# EAGLE design XBP (EAGLE 7.2.0)
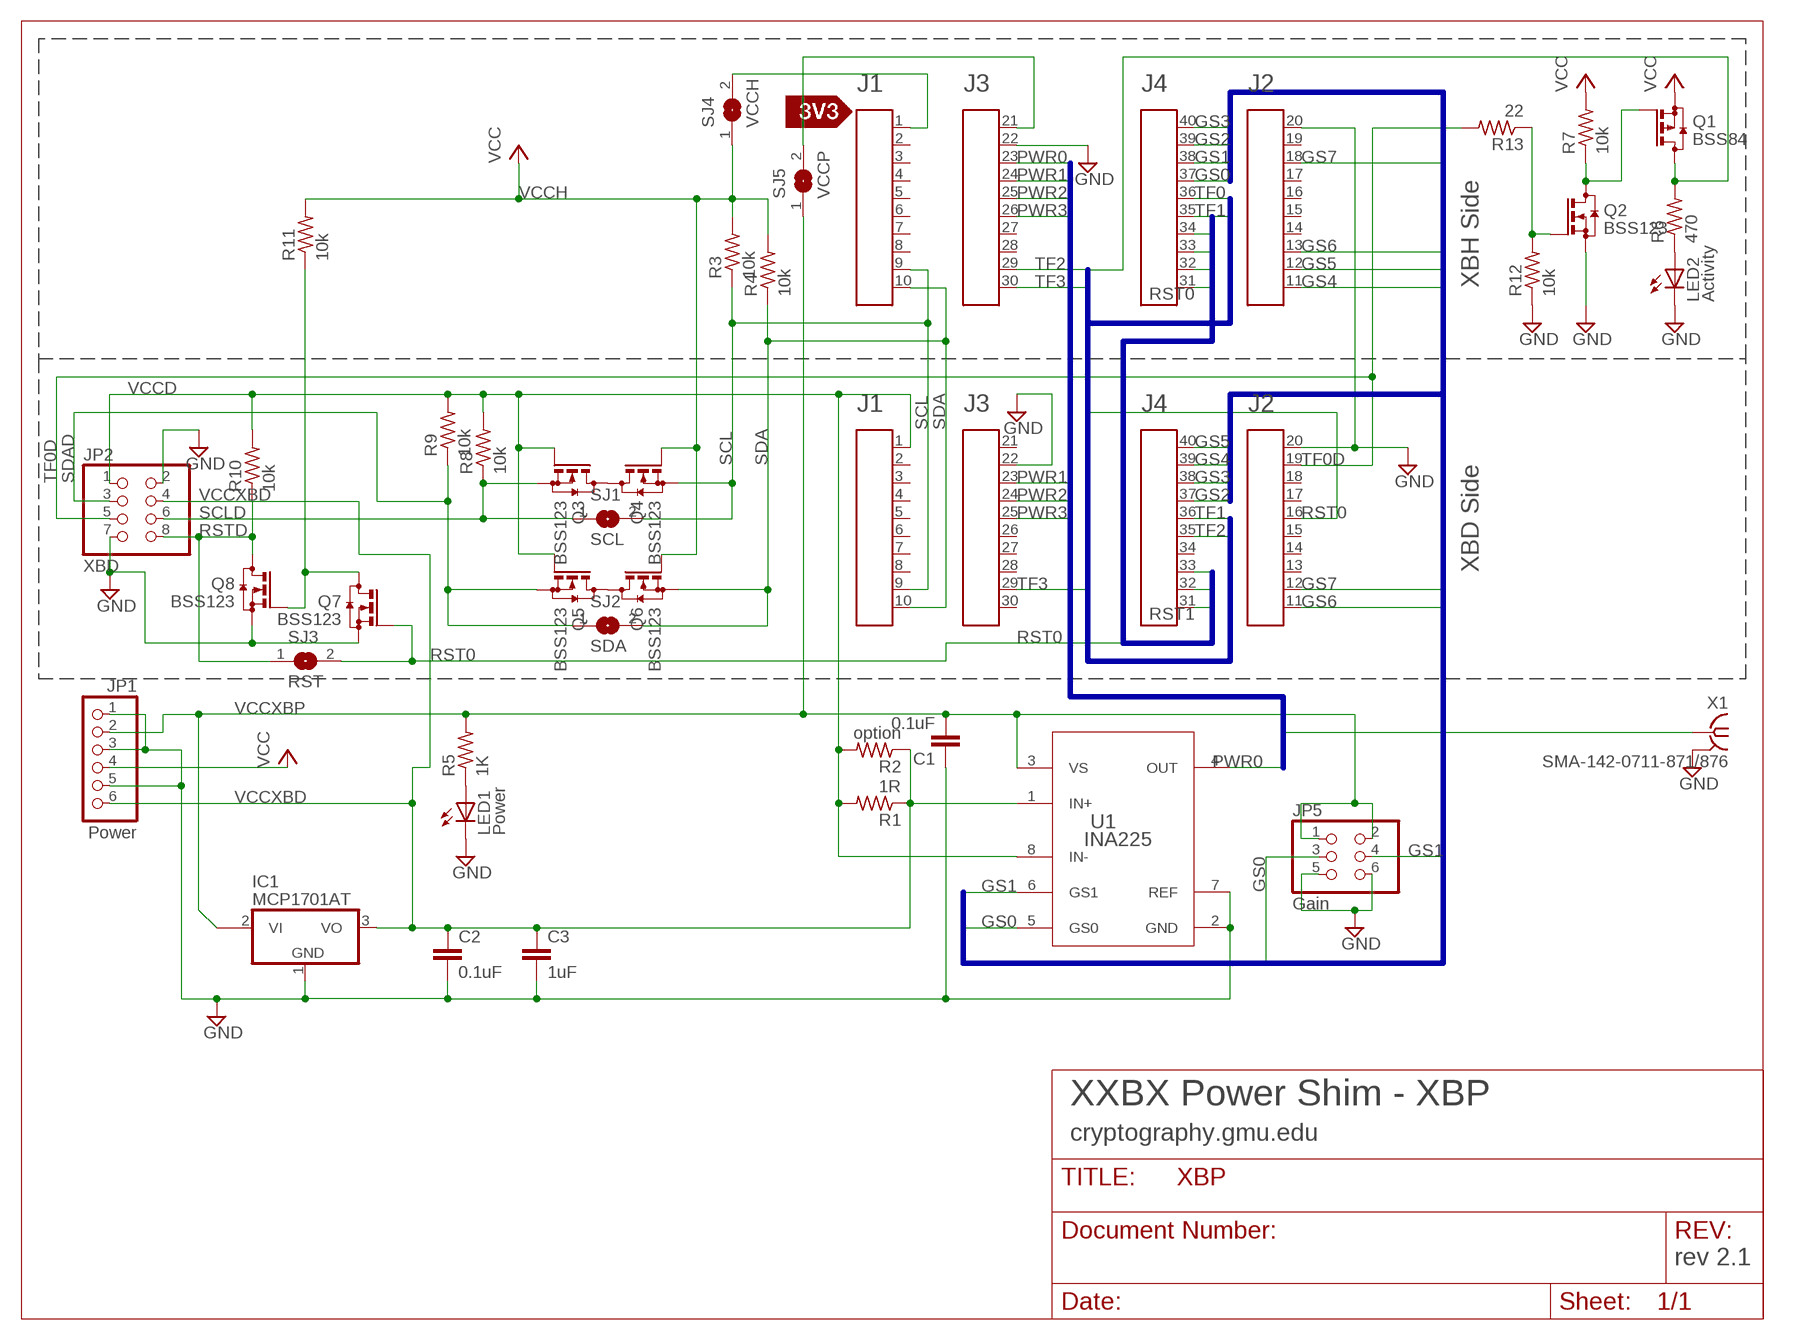
[diagram p0: schematic, sheet 1]

## Parts
A1  XBHCon  HEADER4X10-BOOSTERPACK  [4X10-BOOSTERPACK]
A2  XBDCon  HEADER4X10-BOOSTERPACK  [4X10-BOOSTERPACK]
C1  0.1uF  C-EUC0603  [C0603]
C2  0.1uF  C-EUC0603  [C0603]
C3  1uF  C-EUC0603  [C0603]
IC1  MCP1701AT  MCP170350MB  [SOT89]
JP1  Power  PINHD-1X6/90  [1X06/90]
JP2  XBD  PINHD-2X4/90  [2X04/90]
JP5  Gain  PINHD-2X3  [2X03]
LED1  Power  LEDCHIPLED_0603  [CHIPLED_0603]
LED2  Activity  LEDCHIPLED_0603  [CHIPLED_0603]
Q1  BSS84  [SOT23]
Q2  BSS123  [SOT23]
Q3  BSS123  [SOT23]
Q4  BSS123  [SOT23]
Q5  BSS123  [SOT23]
Q6  BSS123  [SOT23]
Q7  BSS123  [SOT23]
Q8  BSS123  [SOT23]
R1  1R  R-US_R1210  [R1210]
R2  option  R-US_R0805  [R0805]
R3  10k  R-US_R0603  [R0603]
R4  10k  R-US_R0603  [R0603]
R5  1K  R-US_R0603  [R0603]
R6  470  R-US_R0603  [R0603]
R7  10k  R-US_R0603  [R0603]
R8  10k  R-US_R0603  [R0603]
R9  10k  R-US_R0603  [R0603]
R10  10k  R-US_R0603  [R0603]
R11  10k  R-US_R0603  [R0603]
R12  10k  R-US_R0603  [R0603]
R13  22  R-US_R0603  [R0603]
SJ1  SCL  SJ  [SJ]
SJ2  SDA  SJ  [SJ]
SJ3  RST  SJ  [SJ]
SJ4  VCCH  SJ  [SJ]
SJ5  VCCP  SJ  [SJ]
U1  INA225  INA225AIDGKR  [DGK0008A_N]
U3  SILK_3V3_TAG  [SILK_3V3_TAG]
X1  SMA-142-0711-871/876  [J502-ND-142-0711-871/876]

## Nets
GND: A1.20 A1.22 A2.20 A2.22 C1.1 C2.2 C3.2 IC1.1(GND) JP1.1 JP1.3 JP1.5 JP2.2 JP2.7 JP5.5 JP5.6 LED1.C LED2.C Q2.2(S) Q7.2(S) Q8.2(S) R12.1 U1.2(GND) U1.7(REF) X1.G@1 X1.G@2 X1.G@3 X1.G@4
GS0: A1.37 JP5.3 U1.5(GS0)
GS1: A1.38 JP5.4 U1.6(GS1)
GS2: A1.39 A2.37
GS3: A1.40 A2.38
GS4: A1.11 A2.39
GS5: A1.12 A2.40
GS6: A1.13 A2.11
GS7: A1.18 A2.12
N$1: A1.1 SJ4.2
N$2: A1.21 SJ5.2
N$3: LED1.A R5.1
N$4: Q2.1(G) R12.2 R13.1
N$5: LED2.A R6.1
N$7: Q3.3(D) Q4.3(D)
N$9: Q5.3(D) Q6.3(D)
N$10: Q1.1(G) Q2.3(D) R7.1
N$12: Q7.3(D) Q8.1(G) R11.1
PWR0: A1.23 U1.4(OUT) X1.1
PWR1: A1.24 A2.23
PWR2: A1.25 A2.24
PWR3: A1.26 A2.25
RST0: A1.31 A2.16 Q7.1(G) SJ3.2
RST1: A1.32 A2.31
RST2: A1.33 A2.32
RST3: A1.34 A2.33
RSTD: JP2.8 Q8.3(D) R10.1 SJ3.1
SCL: A1.9 A2.9 Q4.2(S) R3.1 SJ1.2
SCLD: JP2.6 Q3.2(S) R8.1 SJ1.1
SDA: A1.10 A2.10 Q6.2(S) R4.1 SJ2.2
SDAD: JP2.3 Q5.2(S) R9.1 SJ2.1
TF0: A1.36 Q1.3(D) R6.2
TF0D: A2.19 JP2.5 R13.2
TF1: A1.35 A2.36
TF2: A1.29 A2.35
TF3: A1.30 A2.29
VCCD: A2.1 JP2.1 Q3.1(G) Q5.1(G) R1.2 R2.2 R8.2 R9.2 R10.2 U1.8(IN-)
VCCH: JP1.4 Q1.2(S) Q4.1(G) Q6.1(G) R3.2 R4.2 R7.2 R11.2 SJ4.1 ; supply symbol labelled VCC
VCCXBD: C2.1 C3.1 IC1.3(VO) JP1.6 JP2.4 R1.1 R2.1 U1.1(IN+)
VCCXBP: C1.2 IC1.2@1(VI1) JP1.2 JP5.1 JP5.2 R5.2 SJ5.1 U1.3(VS)
Unconnected: A1.2 A1.3 A1.4 A1.5 A1.6 A1.7 A1.8 A1.14 A1.15 A1.16 A1.17 A1.19 A1.27 A1.28 A2.2 A2.3 A2.4 A2.5 A2.6 A2.7 A2.8 A2.13 A2.14 A2.15 A2.17 A2.18 A2.21 A2.26 A2.27 A2.28 A2.30 A2.34 IC1.2(VI)

## Buses
RST[0..3]
PWR[0..3]
TF[0..3]
GS[0..7]

## Notes on the sheet
- XBH Side
- XBD Side
- XXBX Power Shim - XBP
- cryptography.gmu.edu
- rev 2.1

## Library data of the parts
A1 A2 = Public_BP_Library:HEADER4X10-BOOSTERPACK
C1-C3 = resistor:C-EU: CAPACITOR, European symbol
IC1 = linear:MCP1703*: 250 mA, 16V, Low Quiescent Current LDO Regulator Source: http://ww1.microchip.com/downloads/en/DeviceDoc/22049b.pdf
JP1 = pinhead:PINHD-1X6: PIN HEADER
JP2 = pinhead:PINHD-2X4: PIN HEADER
JP5 = pinhead:PINHD-2X3: PIN HEADER
LED1 LED2 = led:LED: LED OSRAM: - CHIPLED LG R971, LG N971, LY N971, LG Q971, LY Q971, LO R971, LY R971 LH N974, LH R974 LS Q976, LO Q976, LY Q976 LO Q996 - Hyper CHIPLED LW Q18S LB Q993, LB Q99A, LB R99A - SideLED LS A670, LO A670, LY A670, LG A670, LP A670 LB A673, LV A673, LT A673, LW A673 LH A674 LY A675 LS A676, LA A676, LO A676, LY A676, LW A676 LS A679, LY A679, LG A679 - Hyper Micro SIDELED® LS Y876, LA Y876, LO Y876, LY Y876 LT Y87S - SmartLED LW L88C, LW L88S LB L89C, LB L89S, LG L890 LS L89K, LO L89K, LY L89K LS L896, LA L896, LO L896, LY L896 - TOPLED LS T670, LO T670, LY T670, LG T670, LP T670 LSG T670, LSP T670, LSY T670, LOP T670, LYG T670 LG T671, LOG T671, LSG T671 LB T673, LV T673, LT T673, LW T673 LH T674 LS T676, LA T676, LO T676, LY T676, LB T676, LH T676, LSB T676, LW T676 LB T67C, LV T67C, LT T67C, LS T67K, LO T67K, LY T67K, LW E67C LS E67B, LA E67B, LO E67B, LY E67B, LB E67C, LV E67C, LT E67C LW T67C LS T679, LY T679, LG T679 LS T770, LO T770, LY T770, LG T770, LP T770 LB T773, LV T773, LT T773, LW T773 LH T774 LS E675, LA E675, LY E675, LS T675 LS T776, LA T776, LO T776, LY T776, LB T776 LHGB T686 LT T68C, LB T68C - Hyper Mini TOPLED® LB M676 - Mini TOPLED Santana® LG M470 LS M47K, LO M47K, LY M47K Source: http://www.osram.convergy.de LUXEON: - LUMILED® LXK2-PW12-R00, LXK2-PW12-S00, LXK2-PW14-U00, LXK2-PW14-V00 LXK2-PM12-R00, LXK2-PM12-S00, LXK2-PM14-U00 LXK2-PE12-Q00, LXK2-PE12-R00, LXK2-PE12-S00, LXK2-PE14-T00, LXK2-PE14-U00 LXK2-PB12-K00, LXK2-PB12-L00, LXK2-PB12-M00, LXK2-PB14-N00, LXK2-PB14-P00, LXK2-PB14-Q00 LXK2-PR12-L00, LXK2-PR12-M00, LXK2-PR14-Q00, LXK2-PR14-R00 LXK2-PD12-Q00, LXK2-PD12-R00, LXK2-PD12-S00 LXK2-PH12-R00, LXK2-PH12-S00 LXK2-PL12-P00, LXK2-PL12-Q00, LXK2-PL12-R00 Source: www.luxeon.com KINGBRIGHT: KA-3528ASYC Source: www.kingbright.com
Q1 = transistor-small-signal:BSS84: P-CHANNEL MOS FET
Q2-Q8 = transistor-small-signal:BSS123: N-CHANNEL MOS FET
R1-R13 = resistor:R-US_: RESISTOR, American symbol
SJ1-SJ5 = jumper:SJ: SMD solder JUMPER
U1 = ina225:INA225AIDGKR; ALTERNATEPARTNUMBER: INA225AIDGKT; COMPTYPE: IC; MANUFACTURER: Texas Instruments; MOUNTTYPE: SMT; PACKAGEREFERENCE: DGK0008A; PARTNUMBER: INA225AIDGKR; PIN_COUNT: 8; REFDES: RefDes; ROHS: Y; TYPE: TYPE; VALUE: Value
U3 = Public_BP_Library:SILK_3V3_TAG
X1 = con-coax:SMA-: SMA 50 Ohm End Launch Jack Receptacle - Round Contact Johnson Components Source: www.johnsoncomponents.com .. J502-ND.pdf; MF: JOHNSON COMPONENTS; MPN: 142-0711-871; OC_FARNELL: unknown; OC_NEWARK: 01C1639

## Board
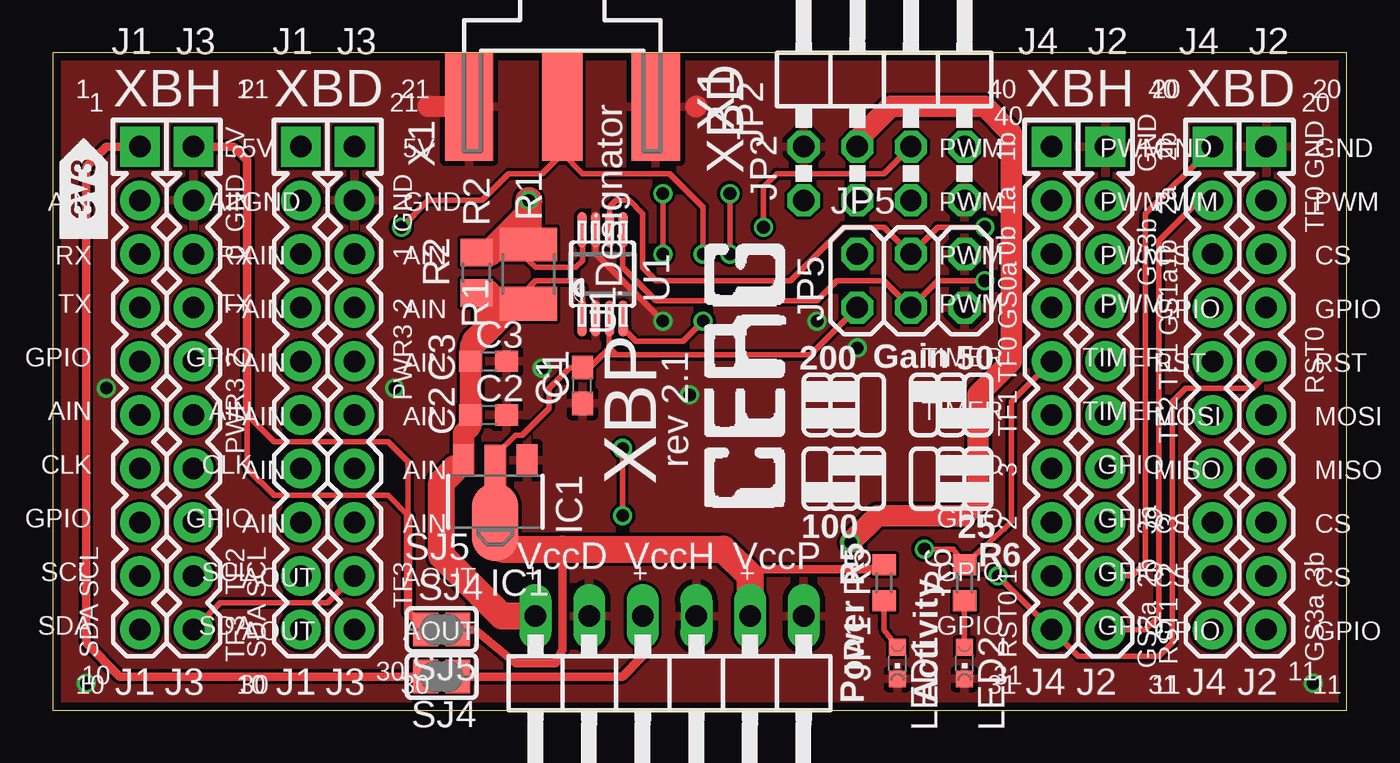
[diagram p1: board, top side]
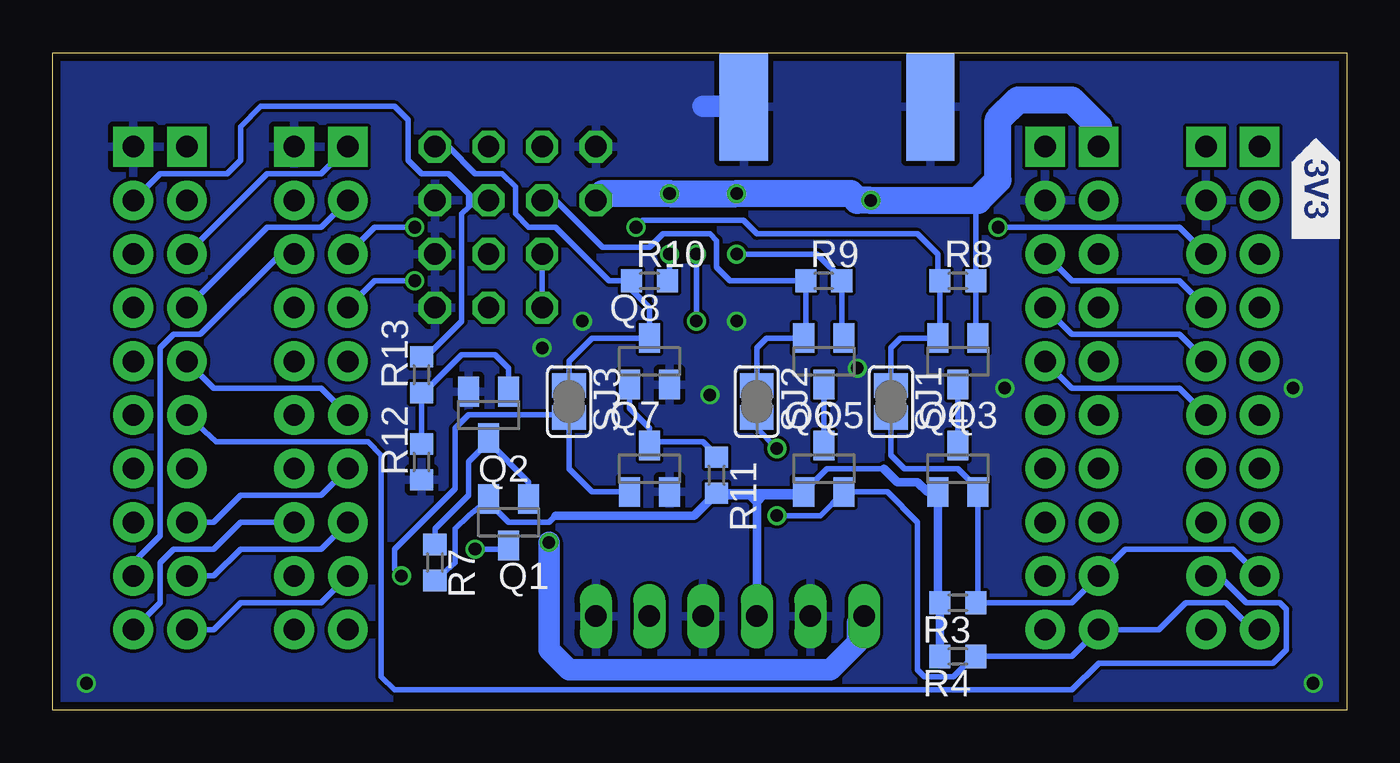
[diagram p2: board, bottom side, seen from below]

Size 61.28 x 31.11 mm. Coordinates in mm from the lower left corner, seen from the top.
Outline: 0,0 61.28,0 61.28,31.11 0,31.11 0,0
Copper layers (1*16): Top 0.035559375mm / dielectric 1.6mm / Bottom 0.035559375mm
Design rules "oshpark-2layer *": minimum track width 6mil, minimum drill 10mil, track to track 6mil, track to pad 6mil, pad to pad 6mil, via to via 6mil, smd to smd 0mil, copper to edge 15mil, drill to drill 6mil, minimum pad ring 5mil, minimum via ring 5mil, stop-mask expansion 2.5mil, vias tented up to drill 30mil, thermal gap 10mil

### Footprints (pad centres in the part's own frame; a part is rotated, then mirrored left to right if it is on the bottom)
4X10-BOOSTERPACK = drill 1.016 pad 1.88 square: 1 0,10.16; 20 45.72,10.16; 21 2.54,10.16; 40 43.18,10.16 | drill 1.016 pad 1.88: 2 0,7.62; 3 0,5.08; 4 0,2.54; 5 0,0; 6 0,-2.54; 7 0,-5.08; 8 0,-7.62; 9 0,-10.16; 10 0,-12.7; 11 45.72,-12.7; 12 45.72,-10.16; 13 45.72,-7.62; 14 45.72,-5.08; 15 45.72,-2.54; 16 45.72,0; 17 45.72,2.54; 18 45.72,5.08; 19 45.72,7.62; 22 2.54,7.62; 23 2.54,5.08; 24 2.54,2.54; 25 2.54,0; 26 2.54,-2.54; 27 2.54,-5.08; 28 2.54,-7.62; 29 2.54,-10.16; 30 2.54,-12.7; 31 43.18,-12.7; 32 43.18,-10.16; 33 43.18,-7.62; 34 43.18,-5.08; 35 43.18,-2.54; 36 43.18,0; 37 43.18,2.54; 38 43.18,5.08; 39 43.18,7.62
C0603 = smd 1.1 x 1: 1 -0.85,0; 2 0.85,0
SOT89 = smd 1 x 1.5: 1 -1.499,-1.981; 3 1.499,-1.981 | smd 1 x 2: 2 0,-1.727 | smd 2.2 x 3.7: 2@1 0,0.94
1X06/90 = drill 1.016 long: 1 -6.35,-3.81; 2 -3.81,-3.81; 3 -1.27,-3.81; 4 1.27,-3.81; 5 3.81,-3.81; 6 6.35,-3.81
2X04/90 = drill 1.016 octagon: 1 -3.81,-6.35; 2 -3.81,-3.81; 3 -1.27,-6.35; 4 -1.27,-3.81; 5 1.27,-6.35; 6 1.27,-3.81; 7 3.81,-6.35; 8 3.81,-3.81
2X03 = drill 1.016 octagon: 1 -2.54,-1.27; 2 -2.54,1.27; 3 0,-1.27; 4 0,1.27; 5 2.54,-1.27; 6 2.54,1.27
CHIPLED_0603 = smd 0.8 x 0.8: A 0,-0.75; C 0,0.75
SOT23 = smd 1 x 1.4: 1 -0.95,-1.1; 2 0.95,-1.1; 3 0,1.1
R1210 = smd 1.6 x 2.7: 1 -1.4,0; 2 1.4,0
R0805 = smd 1.3 x 1.5: 1 -0.95,0; 2 0.95,0
R0603 = smd 1 x 1.1: 1 -0.85,0; 2 0.85,0
SJ = smd 1.168 x 1.6: 1 -0.762,0; 2 0.762,0
DGK0008A_N = smd 1.702 x 0.457: 1 -2.1,0.975; 2 -2.1,0.325; 3 -2.1,-0.325; 4 -2.1,-0.975; 5 2.1,-0.975; 6 2.1,-0.325; 7 2.1,0.325; 8 2.1,0.975
J502-ND-142-0711-871/876 = smd 5.08 x 1.905: 1 2.565,0 | smd 5.08 x 2.286: G@1 2.565,4.42; G@2 2.565,-4.42 | smd 5.08 x 2.286 bottom: G@3 2.565,4.42; G@4 2.565,-4.42

### Placement (x,y rotation side)
A1  4.13,16.51 0 top
A2  11.75,16.51 0 top
C1  25.08,15.37 90 top
C2  20.64,13.97 0 top
C3  20.64,16.51 0 top
IC1  20.95,9.84 180 top
JP1  29.21,0.64 180 top
JP2  39.37,30.48 0 top
JP5  40.64,20.32 0 top
LED1  40.01,2.22 180 top
LED2  43.18,2.22 180 top
Q1  39.69,8.89 180 bottom
Q2  40.64,13.97 180 bottom
Q3  18.41,16.51 180 bottom
Q4  18.41,11.43 0 bottom
Q5  24.77,16.51 180 bottom
Q6  24.77,11.43 0 bottom
Q7  33.02,11.43 0 bottom
Q8  33.02,16.51 0 bottom
R1  22.54,20.64 90 top
R2  20.07,20.7 90 top
R3  18.41,5.08 180 bottom
R4  18.41,2.54 180 bottom
R5  39.37,6.03 90 top
R6  43.18,6.03 90 top
R7  43.18,6.99 270 bottom
R8  18.41,20.32 0 bottom
R9  24.77,20.32 0 bottom
R10  33.02,20.32 0 bottom
R11  29.84,11.11 270 bottom
R12  43.81,11.75 90 bottom
R13  43.81,15.88 90 bottom
SJ1  21.59,14.61 270 bottom
SJ2  27.94,14.61 270 bottom
SJ3  36.83,14.61 270 bottom
SJ4  18.41,1.59 180 top
SJ5  18.41,3.81 180 top
U1  26.04,20.64 90 top
U3  2.6,22.29 90 top
X1  24.13,31.11 270 top

### Tracks (layer width: path | path; a pad name or v marks a point on that pad's centre or on a via)
GND  (via drill 0.6)
  Top 0.254: U1.7 25.71,21.6 v28.89,18.41
  Top 1.016: X1.G@4 17.78,28.57 | 30.45,28.55 30.48,28.57
  Bottom 1.016: 30.48,28.57 28.57,28.57 X1.G@1
  other vias: 30.16,14.92 59.69,1.27 2.54,15.24 1.59,1.27 36.2,18.41 16.19,15.24 23.18,16.19 38.1,17.14
  pour Top: 61.28,31.11 61.28,0 0,0 0,31.11
  pour Bottom: 61.28,31.11 61.28,0 0,0 0,31.11
GS0  (via drill 0.6)
  Top 0.254: U1.5 26.99,22.65 26.99,20.95 28.57,19.37 36.2,19.37 37.15,20.32 39.37,20.32 JP5.3 41.91,20.32 v44.13,20.32
  Bottom 0.254: v44.13,20.32 46.04,20.32 A1.37
GS1  (via drill 0.6)
  Top 0.254: U1.6 26.36,23.82 26.67,24.13 27.3,24.13 27.94,23.5 27.94,20.95 28.57,20.32 34.92,20.32 37.47,22.86 39.37,22.86 JP5.4 41.91,22.86 v44.13,22.86
  Bottom 0.254: A1.38 46.04,22.86 v44.13,22.86
GS2
  Bottom 0.254: A2.37 51.12,22.86 48.58,22.86 A1.39
GS3
  Bottom 0.254: A2.38 51.12,25.4 48.58,25.4 A1.40
GS4
  Top 0.254: A1.11 51.75,3.81 52.39,4.45 52.39,22.23 54.29,24.13 A2.39
GS5
  Top 0.254: A1.12 51.12,6.35 51.75,6.99 51.75,23.5 A2.40
GS6
  Bottom 0.254: A1.13 52.39,8.89 53.66,7.62 55.56,7.62 56.2,6.99 56.2,5.08 A2.11
GS7
  Bottom 0.254: A2.12 57.47,6.99 56.2,8.26 56.2,17.14 55.56,17.78 54.29,17.78 50.48,21.59 A1.18
N$1
  Top 0.406: SJ4.2 3.17,1.59 1.59,3.17 1.59,25.72 2.54,26.67 A1.1
N$2
  Top 0.254: 9.21,13.97 9.21,11.43 10.48,10.16 15.88,10.16 16.83,9.21 16.83,11.75 15.88,12.7 10.48,12.7 9.21,13.97
  Top 0.406: A1.21 8.57,26.67 9.21,26.04 9.21,13.97 | 16.83,9.21 16.83,4.64 SJ5.2
N$3
  Top 0.254: LED1.A 39.37,3.81 R5.1
N$4
  Bottom 0.254: R12.2 R13.1 43.71,15.03 41.91,16.83 40.32,16.83 39.69,16.19 Q2.1
N$5
  Top 0.254: LED2.A R6.1
N$7
  Bottom 0.254: Q3.3 Q4.3
N$9
  Bottom 0.254: Q5.3 Q6.3
N$10
  Bottom 0.254: Q1.1 38.73,10.79 40.64,12.7 | 40.64,12.7 Q2.3 | 40.64,12.7 41.59,11.75 41.59,10.16 43.18,8.57 R7.1
N$12
  Bottom 0.254: Q8.1 33.97,14.29 33.02,13.34 Q7.3 32.85,12.7 30.48,12.7 29.84,12.06 R11.1
PWR0  (via drill 0.6)
  Top 0.254: v30.8,21.59 30.8,23.81 29.21,25.4 25.08,25.4 24.13,26.35 | 24.13,26.35 X1.1 | U1.4 27.13,18.1 27.13,17.95 27.62,17.46 29.84,17.46 v30.8,18.41 | v16.51,22.86 17.78,24.13 20.32,24.13 21.59,25.4 23.18,25.4 24.13,26.35
  Bottom 0.254: v30.8,18.41 v30.8,21.59 | v16.51,22.86 7.94,22.86 A1.23
PWR1
  Bottom 0.254: A1.24 7.94,20.32 13.02,20.32 A2.23
PWR2
  Bottom 0.254: A1.25 7.94,17.78 13.02,17.78 A2.24
PWR3
  Bottom 0.254: A1.26 7.94,15.24 13.02,15.24 A2.25
RST0  (via drill 0.6)
  Top 0.254: A2.16 57.47,15.88 56.83,15.24 53.66,15.24 53.02,14.61 53.02,3.17 52.39,2.54 48.58,2.54 A1.31 v44.77,6.35
  Bottom 0.254: Q7.1 35.73,10.33 36.83,11.43 SJ3.2 37.34,13.84 37.47,13.97 41.59,13.97 42.23,13.34 42.23,10.48 45.09,7.62 45.09,6.67 v44.77,6.35
RST1
  Bottom 0.254: A2.31 53.66,3.81 52.39,5.08 48.58,5.08 A1.32
RST2
  Bottom 0.254: A1.33 48.58,7.62 52.39,7.62 53.66,6.35 A2.32
RST3
  Bottom 0.254: A1.34 48.58,10.16 52.39,10.16 53.66,8.89 A2.33
RSTD
  Bottom 0.254: SJ3.1 36.83,16.51 35.73,17.61 Q8.3 33.02,19.05 33.87,19.9 R10.1 34.92,20.32 37.47,22.86 38.73,22.86 39.37,23.5 39.37,24.77 40.01,25.4 41.27,25.4 42.55,26.67 JP2.8
SCL
  Bottom 0.254: SJ1.2 21.59,12.06 20.95,11.43 18.41,11.43 17.46,10.48 Q4.2 | 17.46,5.08 R3.1 17.57,4.98 17.46,5.08 | 17.46,5.08 13.02,5.08 A2.9 10.48,7.62 5.4,7.62 A1.9 | Q4.2 17.46,10.16 | 17.46,5.08 Q4.2
SCLD  (via drill 0.6)
  Top 0.254: v33.66,22.86 33.66,24.77 34.29,25.4 39.37,25.4 JP2.6
  Bottom 0.254: SJ1.1 21.59,17.14 21.14,17.59 19.36,17.59 Q3.2 19.27,17.71 R8.1 19.37,20.42 19.37,21.59 20.32,22.54 27.94,22.54 28.57,23.18 33.34,23.18 v33.66,22.86
SDA  (via drill 0.6)
  Top 0.254: v26.99,9.21 v26.99,12.38
  Bottom 0.254: Q6.2 23.82,10.48 | A1.10 4.45,3.81 5.71,5.08 7.62,5.08 8.89,3.81 A2.10 13.02,2.54 R4.1 17.57,2.64 18.62,1.59 20,1.59 20.32,1.91 20.32,8.89 21.76,10.33 Q6.2 | Q6.2 24.93,9.21 v26.99,9.21 | v26.99,12.38 27.94,13.34 SJ2.2
SDAD
  Bottom 0.254: SJ2.1 27.94,17.14 27.48,17.61 Q5.2 25.61,17.71 R9.1 29.21,20.32 29.84,20.95 29.84,22.23 30.16,22.54 32.38,22.54 33.02,21.91 35.24,21.91 37.47,24.13 JP2.3
TF0  (via drill 0.6)
  Top 0.254: v41.27,7.62 42.65,7.62 R6.2 45.4,8.89 45.4,14.61 A1.36
  Bottom 0.254: v41.27,7.62 39.86,7.62 arc-90 Q1.3
TF0D
  Bottom 0.254: A2.19 56.2,25.4 53.02,25.4 52.39,26.04 52.39,27.62 51.44,28.57 45.09,28.57 44.45,27.94 44.45,26.04 43.81,25.4 42.55,25.4 41.59,24.45 | JP2.5 41.27,24.13 | 41.27,24.13 41.59,24.45 | 41.59,23.81 41.59,24.45 | 41.59,23.81 41.27,24.13 | R13.2 43.6,16.73 41.91,18.41 41.91,23.5 41.59,23.81
TF1
  Bottom 0.254: A2.36 53.66,15.24 48.58,15.24 A1.35
TF2
  Bottom 0.254: A2.35 53.53,12.7 46.35,12.7 45.72,12.06 45.72,1.59 45.09,0.95 13.02,0.95 11.75,2.22 3.49,2.22 2.86,2.86 2.86,4.76 3.17,5.08 4.76,5.08 6.03,6.35 A1.29
TF3
  Top 0.254: A1.30 7.94,5.08 13.02,5.08 A2.29
VCCD  (via drill 0.6)
  Top 0.254: U1.8 25.08,22.65 25.08,21.27 24.77,20.95 22.86,20.95 22.54,21.27 R1.2 | v28.89,21.59 v28.89,24.45 | v32.07,21.59 v32.07,24.45
  Top 1.27: v22.54,24.13 R1.2 22.36,23.31 20.7,21.65 R2.2
  Bottom 0.254: R9.2 23.91,17.71 Q5.1 | Q3.1 17.57,17.71 R8.2 17.57,23.6 17.46,24.13 | R9.2 23.91,19.27 | R9.2 23.81,20.32 25.08,21.59 v28.89,21.59 | R10.2 32.07,20.32 v32.07,21.59
  Bottom 1.27: A2.1 11.75,27.62 13.02,28.89 15.56,28.89 16.51,27.94 16.51,25.08 17.46,24.13 v22.54,24.13 23.18,24.13 23.5,24.45 v28.89,24.45 v32.07,24.45 35.24,24.45 JP2.1
VCCH
  Top 0.406: SJ4.1 26.99,1.59 27.94,2.54 JP1.4
  Bottom 0.254: R7.2 42.23,6.99 42.23,8.57 41.59,9.21 Q1.2 40.64,9.84 39.69,8.89 37.78,8.89 37.47,9.21 | R3.2 19.27,5.29 | Q6.1 24.61,11.43 21.91,11.43 | R4.2 19.37,2.54
  Bottom 0.406: JP1.4 27.94,9.84 | 27.94,9.84 27.62,10.16 25.89,10.16 Q6.1 | 27.94,9.84 28.26,10.16 29.74,10.16 R11.2 | R11.2 25.82,10.26 25.72,10.16 | R4.2 R3.2 | 19.27,5.29 19.36,5.39 Q4.1 19.86,10.33 20.32,10.79 21.27,10.79 21.91,11.43 | R11.2 30.9,9.21 37.47,9.21
VCCXBD  (via drill 0.6)
  Top 0.254: U1.1 25.08,18.5 25.08,20 24.77,20.32 22.86,20.32 22.54,20 R1.1 22.54,19.05 | 19.05,11.43 19.06,11.43 IC1.3
  Top 1.016: C3.1 C2.1 19.79,13.44 19.46,13.11 IC1.3 | 19.79,16.93 C3.1 | C3.1 19.79,17.25 20,17.46 | JP2.4 38.1,26.99 39.69,28.57 44.13,28.57 45.4,27.3 45.4,16.51 43.81,14.92 43.81,9.84 43.18,9.21 39.05,9.21 v37.78,7.94
  Top 1.27: R2.1 20.57,19.75 20.57,18.03 | 19.05,11.43 18.41,10.79 18.41,7.3 21.27,4.45 JP1.6 | 20.57,18.03 20,17.46 | 20.64,18.1 21.91,19.37 22.41,19.37 R1.1 21.09,19.24 20.64,19.68 20.64,18.1 | 20.64,18.1 20.57,18.03
  Bottom 1.016: v37.78,7.94 37.78,2.86 36.83,1.91 24.45,1.91 23.18,3.17 23.18,4.13 JP1.6
VCCXBP
  Top 0.254: 26.04,16.83 25.42,16.22 C1.2 24.47,16.22 23.5,15.24 23.5,14.29 22.23,13.02 21.91,13.02 20.95,12.06 IC1.2@1 | 26.04,16.83 26.35,17.14 | 26.35,17.14 U1.3 | JP5.1 35.88,16.83 26.67,16.83 | 26.35,17.14 26.67,16.83 | 26.67,16.83 26.04,16.83
  Top 0.406: SJ5.1 20,3.81 21.91,2.22 23.81,2.22 24.13,2.86 24.13,7.62 | 33.02,6.35 33.66,6.67 38.73,6.67 R5.2
  Top 1.27: IC1.2@1 20.95,8.26 21.27,7.62 24.13,7.62 31.75,7.62 33.02,6.35 JP1.2
  Bottom 0.254: JP5.2 JP5.1

### Text on the board
_tsilk: XBH | XBD | XBH | XBD | 1 | 21 | 40 | 20 | 5V | X1 | 1b | 2b | XBD | GND | GND | JP2 | GND | GND | R2 | R1 | 1a | 2a | TF0 | U1 | 0b | 0 | 1 | 1b | GS3b | 1 | 2 | JP5 | GS0a | GS1a | 2 | C3 | 200 | Gain | 50 | PWR3 | TF0 | TF1 | RST0 | C1 | XBP | rev 2.1 | C2 | TF1 | TF2 | PWR3 | IC1 | 3 | 100 | 25 | 2 | 3 | SJ5 | R5 | R6 | 3a | VccD | VccH | VccP | SJ4 | + | + | + | 1 | 2b | 2 | 3b | SCL | TF2 | SCL | TF3 | SDA | 10 | J1 | J3 | TF3 | SDA | J1 | J3 | RST0 | 31 | J4 | J2 | GS2a | RST1 | J4 | J2 | GS3a | 30 | 11 | Power | Activity
_bsilk: XBD | XXBX Power Shim-XBP | GND | VIN | SCL | RST | VCC | SDA | TF | GND | R8 | R9 | R10 | Q3 | SJ1 | SJ2 | Q8 | SJ3 | Q5 | Q2 | SCL | SDA | RST | R13 | R11 | Q4 | Q6 | Q7 | R12 | Q1 | R7 | R3 | cryptography.gmu.edu | R4